# Altium schematic sheet CONTROLLER.SchDoc (part 2 of 2)
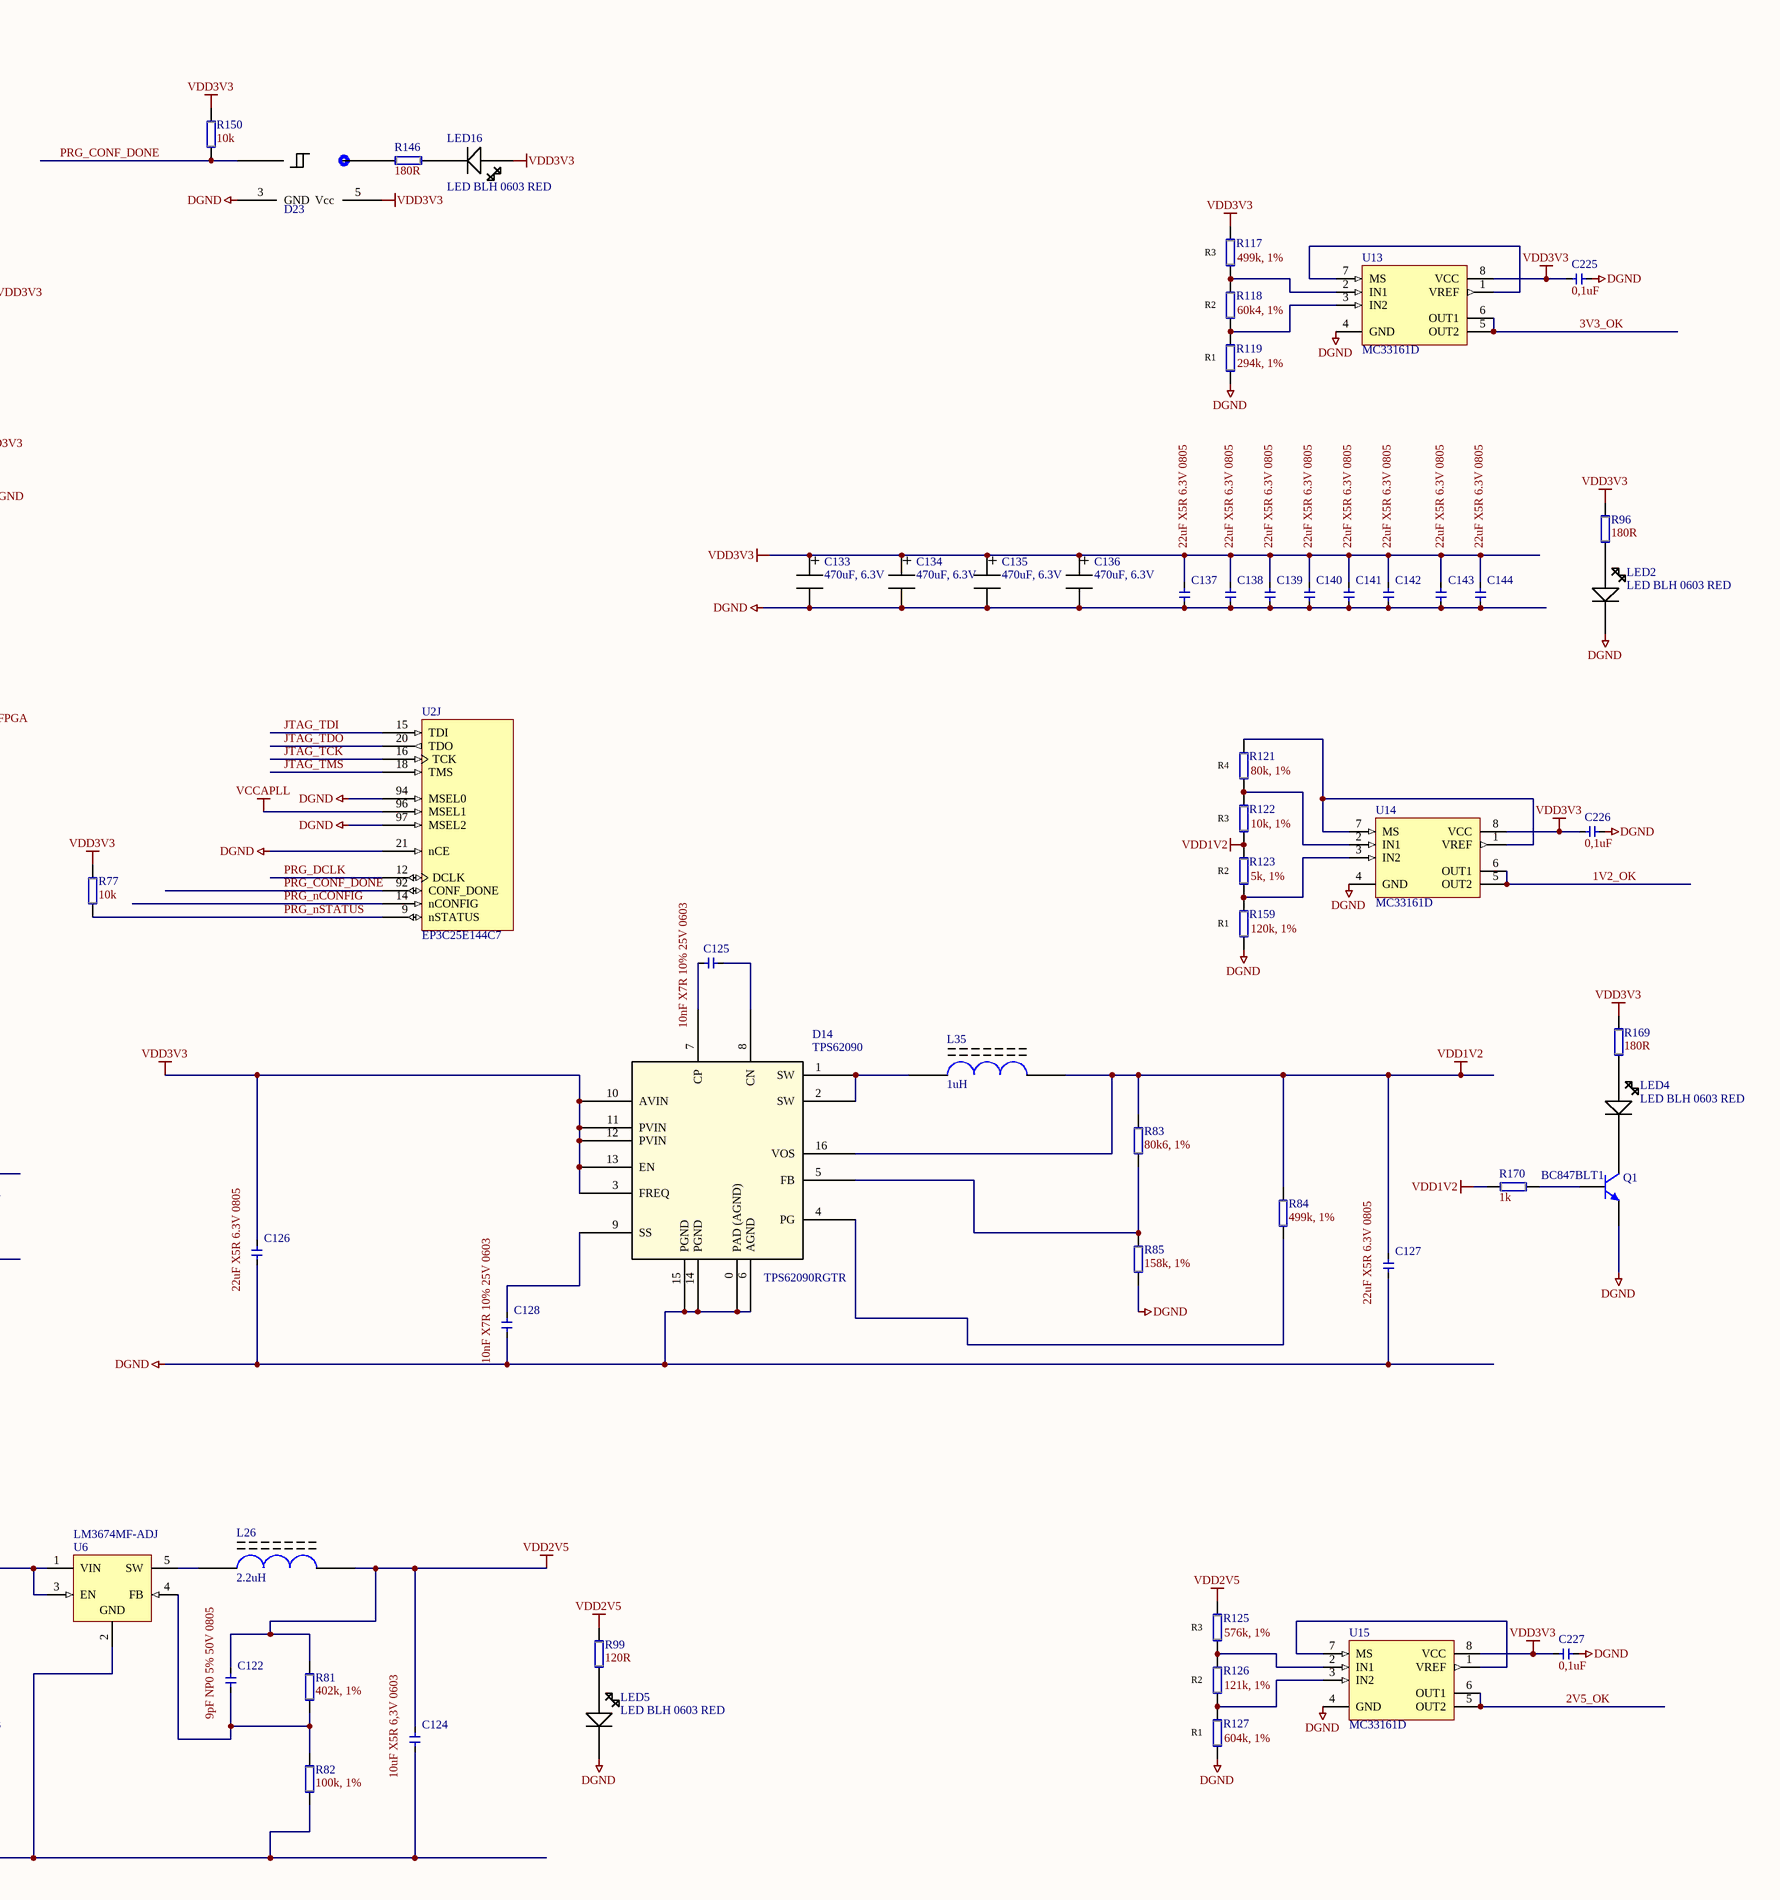
[diagram p6: CONTROLLER.SchDoc, bottom right]

## Library data of the parts
C1-C45 C65-C76 C78-C89 C91-C104 C107 C110-C117 C120-C132 C137-C144 C148 C154-C157 C161-C165 C169-C173 C177-C181 C185 C186 C188 C225-C227 = ChipCapacitor
C77 C133-C136 = C
D19-D23 = SN74AHC1G14 (INV SH-TRG): Value: SN74AHC1G14
ISO1-ISO10 = ISO7140: ISO7140 quad channel digital isolator
J1 = J0011D01BNL RJ45wMagnetics: Rule: UNIONINDEX{}0[]RULEKIND{}PlaneConnect[]NETSCOPE{}AnyNet[]LAYERKIND{}SameLayer[]NAME{}Schematic Power Plane Connect Style[]PLANECONNECTSTYLE{}Relief[]RELIEFEXPANSION{}15.748mil[]RELIEFENTRIES{}4[]RELIEFCONDUCTORWIDTH{}15.748mil[]RELIEFAIRGAP{}15.748mil[]UNIT{}Imperial[]PcbType{}ProtelPcb
L1-L6 L8-L22 L25 = SMD_IND_LQM21: Value: BLM21PG600SN1D
L26 = Inductor CDRH2D14
L35 = Inductor LQH66S
L36 = SMD_IND_LQM21: Value: BLM21PG220SN1D
LED2 LED4 LED5 LED12-LED16 = LED BLH: BLH LED
Q1 = BC847BLT1: General Purpose Transistor NPN Silicon; Published: 29-Sep-2000; LatestRevisionDate: 17-Jul-2002; LatestRevisionNote: Re-released for DXP Platform.; DatasheetVersion: 1997; PackageVersion: 1997; PackageReference: 318-08; Publisher: Altium Limited; PackageDescription: SOT-23; 3 Leads; Body 3.0 x 2.6 mm, inc. leads (LxW max); ComponentLink1Description: Manufacturer Link; ComponentLink1URL: http://www.onsemi.com/site/products/landing?taxonomyID=194; ComponentLink2Description: Datasheet; ComponentLink2URL: http://www.onsemi.com/pub/Collateral/BC846ALT1-D.PDF
R3 R6 R8 R10-R23 R25-R50 R52-R56 R58-R64 R76-R112 R114 R115 R117-R119 R121-R123 R125-R127 R129-R146 R150-R201 = ChipResistor
RECONF = Button TYCO 1-1825910-4 Vert: Rule: UNIONINDEX{}0[]RULEKIND{}PlaneConnect[]NETSCOPE{}AnyNet[]LAYERKIND{}SameLayer[]NAME{}Schematic Power Plane Connect Style[]PLANECONNECTSTYLE{}Relief[]RELIEFEXPANSION{}15.748mil[]RELIEFENTRIES{}4[]RELIEFCONDUCTORWIDTH{}15.748mil[]RELIEFAIRGAP{}15.748mil[]UNIT{}Imperial[]PcbType{}ProtelPcb
RESET = Button 1-1825027-1: Button TYCO 1-1825027-1; Rule: UNIONINDEX{}0[]RULEKIND{}PlaneConnect[]NETSCOPE{}AnyNet[]LAYERKIND{}SameLayer[]NAME{}Schematic Power Plane Connect Style[]PLANECONNECTSTYLE{}Relief[]RELIEFEXPANSION{}15.748mil[]RELIEFENTRIES{}4[]RELIEFCONDUCTORWIDTH{}15.748mil[]RELIEFAIRGAP{}15.748mil[]UNIT{}Imperial[]PcbType{}ProtelPcb
U1 = F28M35H52C_RFP_1: Imported; Manufacturer_Part_Number: f28m35h52c_rfp_144; Vendor: Texas Instruments; PACKAGE_DESIGNATOR: RFP; PIN_COUNT: 144; FAMILY_NAME: 28x + ARM&#174; Cortex&#153; M3 Concerto&#153; Series; INDUSTRY_STD_PKG_TYPE: HTQFP; GENERIC_PART_NUMBER: F28M35H52C; Datasheet URL: http://www.ti.com/lit/gpn/F28M35H52C; Manufacturer: Texas Instruments; RefDes: RefDes; Type: DEV; Value: Value
U2 = EP3C25E144C7: Cyclone III Family FPGA, 82 I/O Pins, 4 PLLs, 144-Pin EQFP, Speed Grade 7, Commercial Grade; Note: Exposed pad at the bottom of this package must be connected to PCB GND.; Published: 26-Feb-2007; LatestRevisionDate: 14-Dec-2007; LatestRevisionNote: Thermal Pad dimensions changed.; DatasheetVersion: ver2.0, May-2008; PackageVersion: ver15.1, May-2008; PackageReference: EQFP144; Publisher: Altium Limited; PackageDescription: 144-Pin Plastic Enhanced Quad Flat Pack (EQFP144) - Wire Bond; Code_JEDEC: MS-026-BFB; ComponentLink1Description: Manufacturer Link; ComponentLink1URL: http://www.altera.com/; ComponentLink2Description: Handbook (7.86MB); ComponentLink2URL: http://www.altera.com/literature/hb/cyc3/cyclone3_handbook.pdf; ComponentLink3Description: Packaging Specification; ComponentLink3URL: http://www.altera.com/literature/ds/dspkg.pdf
U5 = EPCS64SI16N: EPCS64 Series, In-system programmable 3.3V serial configuration device, 16-Pin SOIC, 64-Megabit, Industrial Grade, Pb-Free; Configures: Cyclone II, Stratix II, & Cyclone Devices; Published: 4-Mar-2005; LatestRevisionDate: 13-Apr-2006; LatestRevisionNote: IPC-7351 Footprint Added.; DatasheetVersion: ver2.0, Oct-2003; PackageVersion: ver14.2, Oct-2005; PackageReference: SOIC16; Publisher: Altium Limited; PackageDescription: 16-Pin Small Outline Integrated Circuit Package (SOIC16); Supplier 1: Digi-Key; Supplier Part Number 1: 544-1380-5-ND; Code_JEDEC: MS-013-AA; Code_IPC: SOIC127P1030-16; ComponentLink1Description: Manufacturer Link; ComponentLink1URL: http://www.altera.com/products/devices/config/cfg-index.html; ComponentLink2Description: Configuration Handbook; ComponentLink2URL: http://www.altera.com/literature/hb/cfg/config_handbook.pdf; ComponentLink3Description: Pinout Specification; ComponentLink3URL: http://www.altera.com/literature/hb/cfg/config_handbook.pdf; ComponentLink4Description: Packaging Specification; ComponentLink4URL: http://www.altera.com/support/devices/packaging/specifications/pkg-pin/pdf/016-SOIC.pdf
U6 = LM3674MF-ADJ: 2MHz, 600mA Step-Down DC-DC Converter, 5-pin SOT-23; Manufacturer: National Semiconductor; PackageTopMarking: SLTB*XTT; PowerWise: Y; CompType: MiscPower; Published: 4-Dec-2008; DatasheetVersion: Sep-2006; PackageVersion: revD, Aug-2008; PackageReference: MF05A; Publisher: Altium Limited; PackageDescription: Molded SOT-23, .115 x .063 x .040 in Body, 5 Lead, .0375 in Pitch; Supplier 1: Farnell; Supplier Part Number 1: 1312587; PartNumber: LM3674MF-ADJ; RoHS: N; PinCount: 5; ComponentLink1Description: LM3674 Datasheet; ComponentLink1URL: http://www.national.com/ds/LM/LM3674.pdf; ComponentLink2Description: LM3674 Web Page; ComponentLink2URL: http://www.national.com/pf/LM/LM3674.html; ComponentLink3Description: MF05A Package Page; ComponentLink3URL: http://www.national.com/packaging/folders/mf05a.html
U7 = AT25DF321A Flash
U13-U15 = MC33161D: Universal Voltage Monitor; Published: 15-Apr-2002; LatestRevisionDate: 13-Apr-2006; LatestRevisionNote: IPC-7351 Footprint Added.; DatasheetVersion: Apr-2000; PackageVersion: 1998; PackageReference: 751-05; Publisher: Altium Limited; PackageDescription: 8-Pin Small Outline Integrated Circuit 1.27 mm Pitch; Code_JEDEC: MS-012-AA; Code_IPC: SOIC127P600-8; ComponentLink1Description: Manufacturer Link; ComponentLink1URL: http://www.onsemi.com/site/products/taxonomy/0,4438,503,00.html; ComponentLink2Description: Datasheet; ComponentLink2URL: http://www.onsemi.com/pub/Collateral/MC34161-D.PDF
UR1 UR2 = REF30XX: 50ppm/°C Max, 50µA in SOT23-3  CMOS VOLTAGE REFERENCE
X1 = TI 20pin JTAG: Rule: UNIONINDEX{}0[]RULEKIND{}PlaneConnect[]NETSCOPE{}AnyNet[]LAYERKIND{}SameLayer[]NAME{}Schematic Power Plane Connect Style[]PLANECONNECTSTYLE{}Relief[]RELIEFEXPANSION{}11.811mil[]RELIEFENTRIES{}4[]RELIEFCONDUCTORWIDTH{}23.622mil[]RELIEFAIRGAP{}11.811mil[]UNIT{}Imperial[]PcbType{}ProtelPcb
X2 = Header 5X2: Header, 5-Pin, Dual row; Rule: UNIONINDEX{}0[]RULEKIND{}PlaneConnect[]NETSCOPE{}AnyNet[]LAYERKIND{}SameLayer[]NAME{}Schematic Power Plane Connect Style[]PLANECONNECTSTYLE{}Relief[]RELIEFEXPANSION{}15.748mil[]RELIEFENTRIES{}4[]RELIEFCONDUCTORWIDTH{}15.748mil[]RELIEFAIRGAP{}15.748mil[]UNIT{}Imperial[]PcbType{}ProtelPcb; LatestRevisionDate: 17-Jul-2002; LatestRevisionNote: Re-released for DXP Platform.; Publisher: Altium Limited
X3-X5 = Conn 64pos 51205xx-1: Connector 64 pos TE
XT1 XT2 = KXO-V97
XTAL1 XTAL2 = Crystal_KX-7